# Altium project haptic_core_v2.PrjPcb (part 2 of 2)

## Sheet MCU_nRF5340.SchDoc
size A2; SheetNumber: 2; SheetTotal: 5
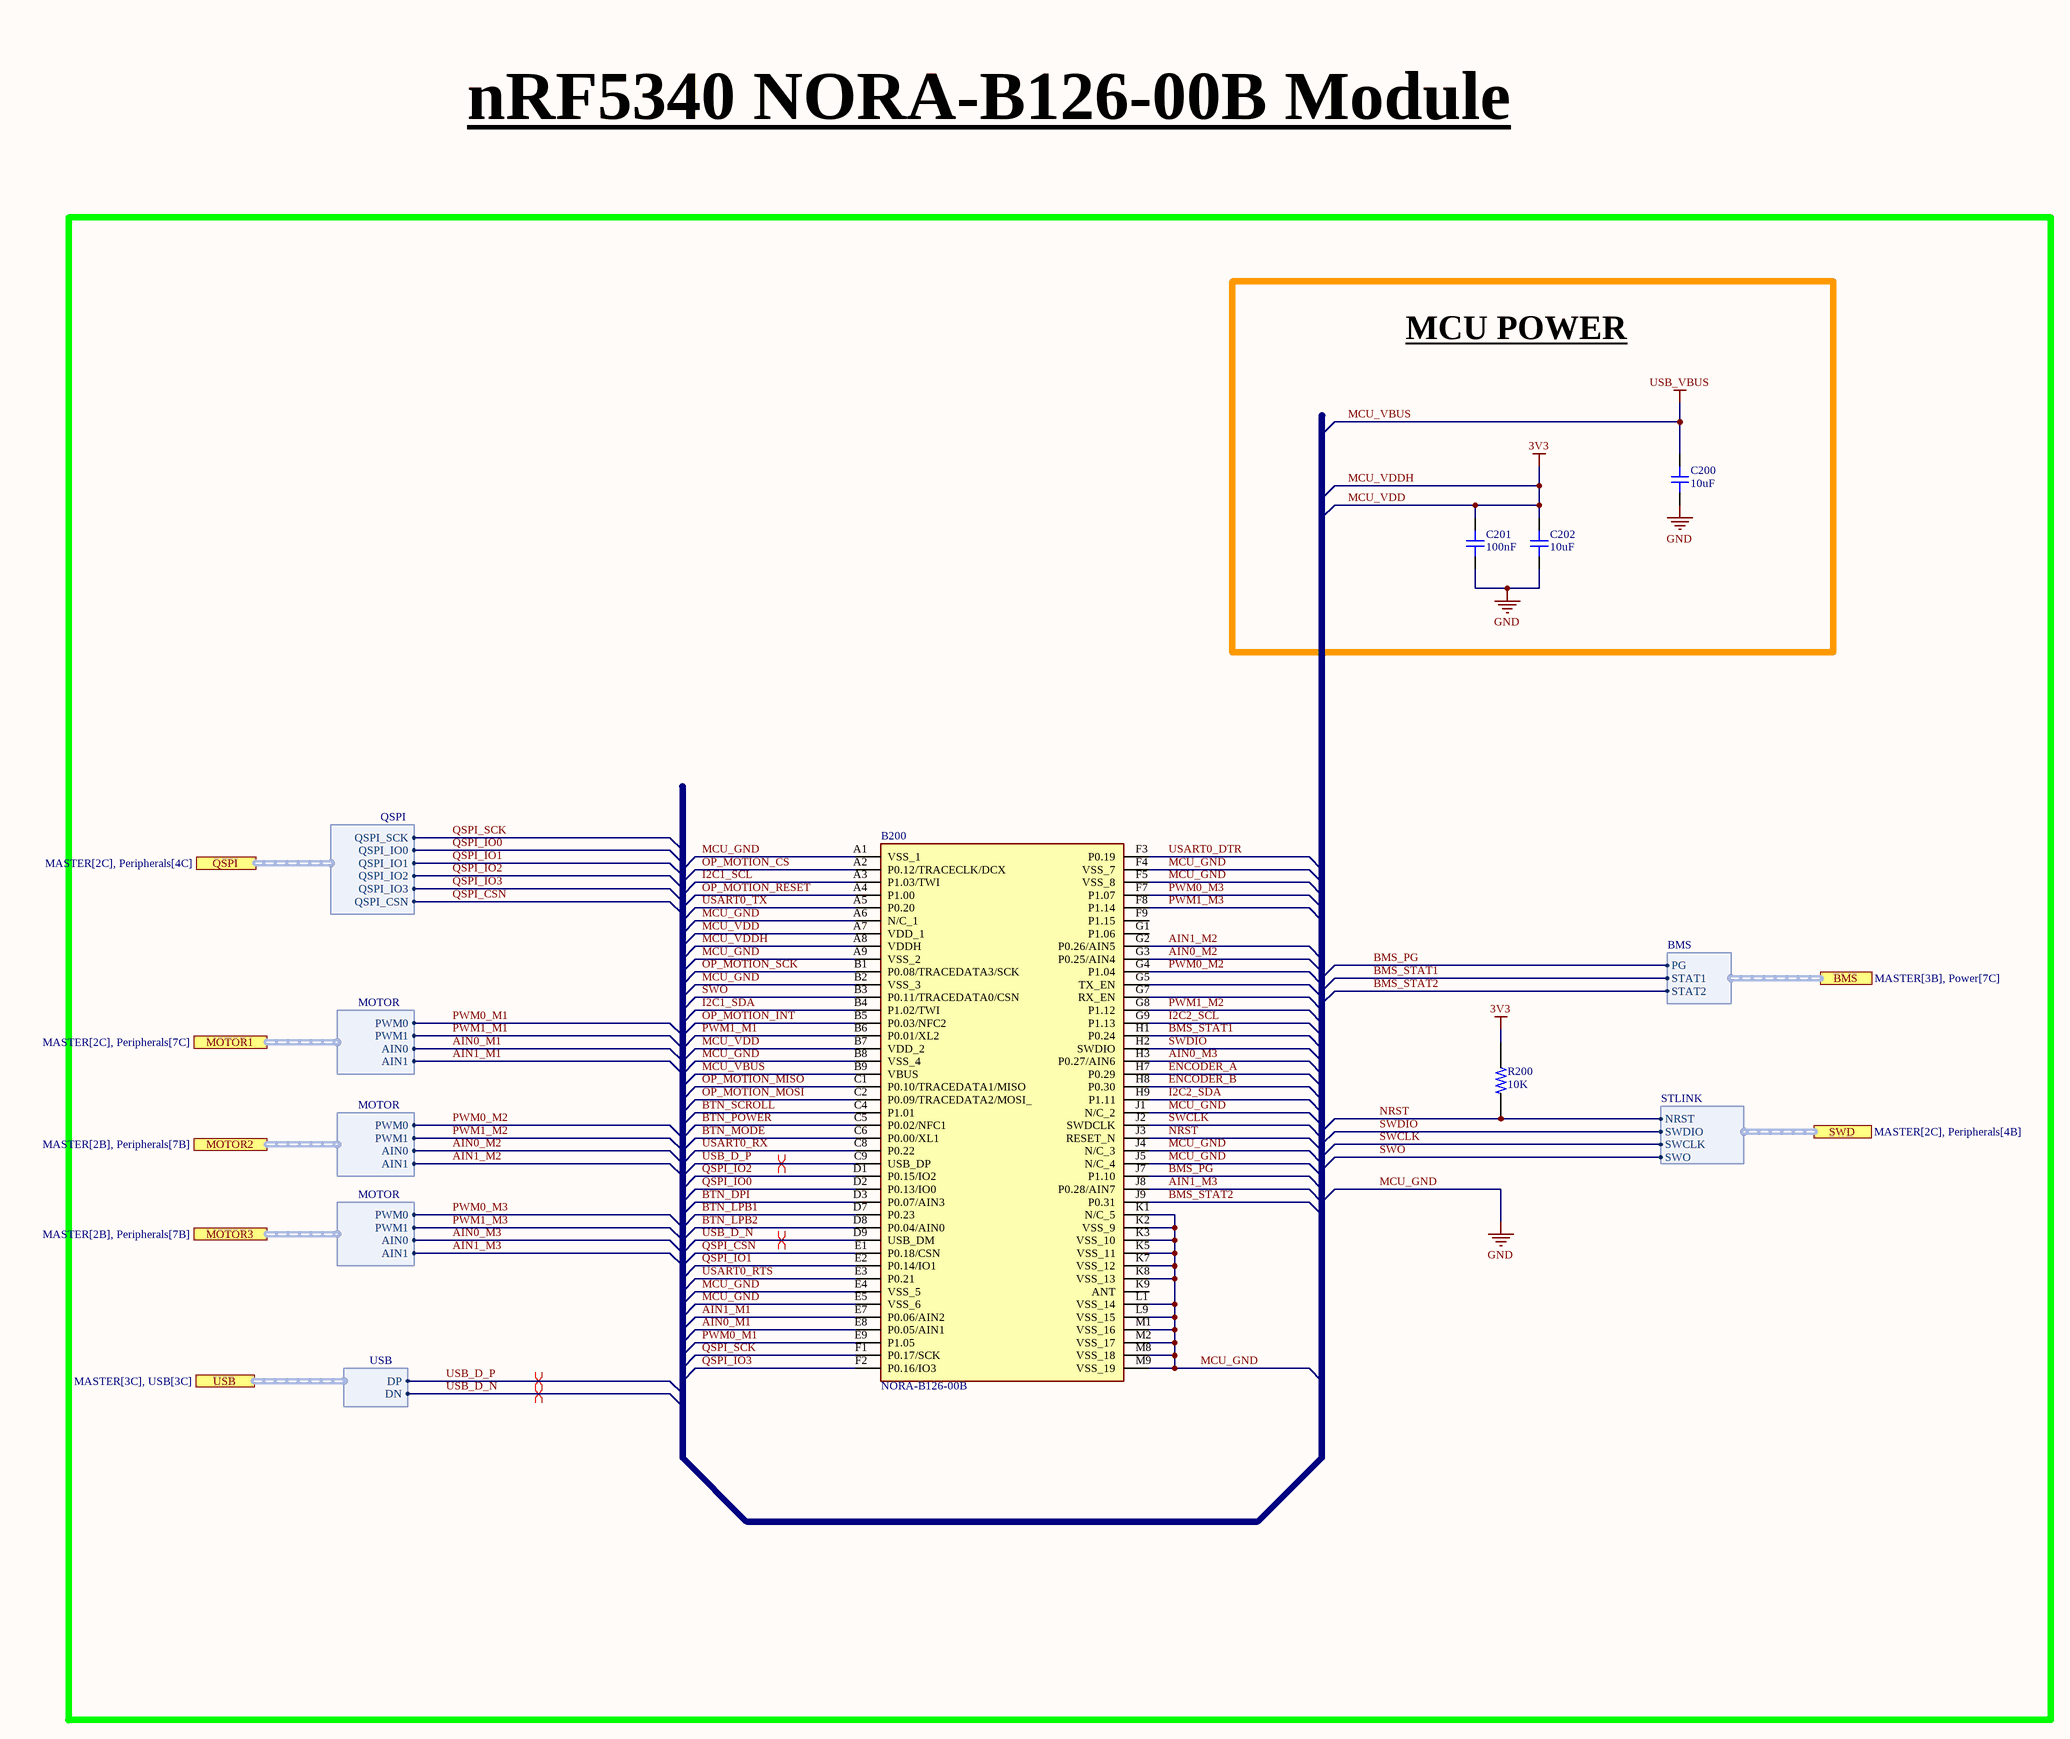
[diagram p4: MCU_nRF5340.SchDoc]

### Parts
B200  NORA-B126-00B  [NORAB12600B]
C200  10uF  [CAP_0603]
C201  100nF  [CAP_0603]
C202  10uF  [CAP_0603]
R200  10K  [RESC1607X60N]

### Blocks framed on the sheet
MCU POWER: C200-C202

### Ports
BMS (harness BMS, see MASTER[3B], Power[7C]), MOTOR1 (harness MOTOR, see MASTER[2C], Peripherals[7C]), MOTOR2 (harness MOTOR, see MASTER[2B], Peripherals[7B]), MOTOR3 (harness MOTOR, see MASTER[2B], Peripherals[7B]), QSPI (harness QSPI, see MASTER[2C], Peripherals[4C]), SWD (harness STLINK, see MASTER[2C], Peripherals[4B]), USB (harness USB, see MASTER[3C], USB[3C])

### Harnesses
QSPI: QSPI_SCK, QSPI_IO0, QSPI_IO1, QSPI_IO2, QSPI_IO3, QSPI_CSN
STLINK: NRST, SWDIO, SWCLK, SWO
BMS: PG, STAT2, STAT1
USB: DN, DP
MOTOR: PWM1, PWM0, AIN0, AIN1

### Nets
MCU_GND: B200.A1(VSS_1) B200.A6(N/C_1) B200.A9(VSS_2) B200.B2(VSS_3) B200.B8(VSS_4) B200.E4(VSS_5) B200.E5(VSS_6) B200.F4(VSS_7) B200.F5(VSS_8) B200.J1(N/C_2) B200.J4(N/C_3) B200.J5(N/C_4) B200.K1(N/C_5) B200.K2(VSS_9) B200.K3(VSS_10) B200.K5(VSS_11) B200.K7(VSS_12) B200.K8(VSS_13) B200.L1(VSS_14) B200.L9(VSS_15) B200.M1(VSS_16) B200.M2(VSS_17) B200.M8(VSS_18) B200.M9(VSS_19) C200.1 C201.1 C202.1  [also labelled GND]
MCU_VBUS: B200.B9(VBUS) C200.2  [also labelled USB_VBUS]
MCU_VDD: B200.A7(VDD_1) B200.A8(VDDH) B200.B7(VDD_2) C201.2 C202.2 R200.1  [also labelled 3V3, MCU_VDDH]
AIN0_M1: B200.E8(P0.05/AIN1) ; port MOTOR1.AIN0
AIN0_M2: B200.G3(P0.25/AIN4) ; port MOTOR2.AIN0
AIN0_M3: B200.H3(P0.27/AIN6) ; port MOTOR3.AIN0
AIN1_M1: B200.E7(P0.06/AIN2) ; port MOTOR1.AIN1
AIN1_M2: B200.G2(P0.26/AIN5) ; port MOTOR2.AIN1
AIN1_M3: B200.J8(P0.28/AIN7) ; port MOTOR3.AIN1
BMS_PG: B200.J7(P1.10) ; port BMS.PG
BMS_STAT1: B200.H1(P0.24) ; port BMS.STAT1
BMS_STAT2: B200.J9(P0.31) ; port BMS.STAT2
BTN_DPI: B200.D3(P0.07/AIN3)
BTN_LPB1: B200.D7(P0.23)
BTN_LPB2: B200.D8(P0.04/AIN0)
BTN_MODE: B200.C6(P0.00/XL1)
BTN_POWER: B200.C5(P0.02/NFC1)
BTN_SCROLL: B200.C4(P1.01)
ENCODER_A: B200.H7(P0.29)
ENCODER_B: B200.H8(P0.30)
I2C1_SCL: B200.A3(P1.03/TWI)
I2C1_SDA: B200.B4(P1.02/TWI)
I2C2_SCL: B200.G9(P1.13)
I2C2_SDA: B200.H9(P1.11)
NRST: B200.J3(RESET_N) R200.2 ; port SWD.NRST
OP_MOTION_CS: B200.A2(P0.12/TRACECLK/DCX)
OP_MOTION_INT: B200.B5(P0.03/NFC2)
OP_MOTION_MISO: B200.C1(P0.10/TRACEDATA1/MISO)
OP_MOTION_MOSI: B200.C2(P0.09/TRACEDATA2/MOSI_)
OP_MOTION_RESET: B200.A4(P1.00)
OP_MOTION_SCK: B200.B1(P0.08/TRACEDATA3/SCK)
PWM0_M1: B200.E9(P1.05) ; port MOTOR1.PWM0
PWM0_M2: B200.G4(P1.04) ; port MOTOR2.PWM0
PWM0_M3: B200.F7(P1.07) ; port MOTOR3.PWM0
PWM1_M1: B200.B6(P0.01/XL2) ; port MOTOR1.PWM1
PWM1_M2: B200.G8(P1.12) ; port MOTOR2.PWM1
PWM1_M3: B200.F8(P1.14) ; port MOTOR3.PWM1
QSPI_CSN: B200.E1(P0.18/CSN) ; port QSPI.QSPI_CSN
QSPI_IO0: B200.D2(P0.13/IO0) ; port QSPI.QSPI_IO0
QSPI_IO1: B200.E2(P0.14/IO1) ; port QSPI.QSPI_IO1
QSPI_IO2: B200.D1(P0.15/IO2) ; port QSPI.QSPI_IO2
QSPI_IO3: B200.F2(P0.16/IO3) ; port QSPI.QSPI_IO3
QSPI_SCK: B200.F1(P0.17/SCK) ; port QSPI.QSPI_SCK
SWCLK: B200.J2(SWDCLK) ; port SWD.SWCLK
SWDIO: B200.H2(SWDIO) ; port SWD.SWDIO
SWO: B200.B3(P0.11/TRACEDATA0/CSN) ; port SWD.SWO
USART0_DTR: B200.F3(P0.19)
USART0_RTS: B200.E3(P0.21)
USART0_RX: B200.C8(P0.22)
USART0_TX: B200.A5(P0.20)
USB_D_N: B200.D9(USB_DM) ; port USB.DN
USB_D_P: B200.C9(USB_DP) ; port USB.DP

Not connected (* = marked no-connect by the designer): B200 F9(P1.15) G1(P1.06) G5(TX_EN) G7(RX_EN) K9(ANT)

### Layout directives
differential pair: USB_D_N, USB_D_P

### Notes on the sheet
- nRF5340 NORA-B126-00B Module

### Library data of the parts
B200 = NORA-B126-00B: Stand-alone dual-core Bluetooth 5.2 Low Energy and IEEE 802.15.4 module; Manufacturer_Name: u-blox; Geometry.Height: 1.8mm; Mouser Part Number: 377-NORA-B126-00B; Mouser Price/Stock: https://www.mouser.co.uk/ProductDetail/u-blox/NORA-B126-00B?qs=MyNHzdoqoQLrkbXxJ8%252ByHg%3D%3D; Manufacturer_Part_Number: NORA-B126-00B; Datasheet Link: https://content.u-blox.com/sites/default/files/NORA-B1_DataSheet_UBX-20027119.pdf
C200-C202 = CAP_0603: Capacitor SMD 0603; Manufacturer: *; Manufacturer Part Number: *; Distributor Link: *; LCSC: *; Rating: *; Dielectric: *
R200 = RC0603JR0710KL: 10 kOhms Â±5% 0.1W, 1/10W Chip Resistor 0603 (1608 Metric) Moisture Resistant Thick Film; MF: Yageo; SnapEDA_Link: https://www.snapeda.com/parts/RC0603JR0710KL/Yageo/view-part/?ref=snap; Package: 0603 Yageo; Value: *; MP: RC0603JR0710KL; Check_prices: https://www.snapeda.com/parts/RC0603JR0710KL/Yageo/view-part/?ref=eda

## Nets that join several sheets
MCU_GND: Power (32 pins), USB (14 pins), Peripherals (19 pins), MCU_nRF5340 (27 pins)
MCU_VBUS: Power (9 pins), USB (8 pins), MCU_nRF5340 (B200.B9 C200.2)
MCU_VDD: Power (C415.2 C416.2 U402.5), Peripherals (12 pins), MCU_nRF5340 (6 pins)
AIN0_M1: Peripherals (C303.2 R301.1), MCU_nRF5340 (B200.E8)
AIN0_M2: Peripherals (C307.2 R303.1), MCU_nRF5340 (B200.G3)
AIN0_M3: Peripherals (C311.2 R305.1), MCU_nRF5340 (B200.H3)
AIN1_M1: Peripherals (C304.2 R300.2), MCU_nRF5340 (B200.E7)
AIN1_M2: Peripherals (C308.2 R302.2), MCU_nRF5340 (B200.G2)
AIN1_M3: Peripherals (C312.2 R304.2), MCU_nRF5340 (B200.J8)
BMS_PG: Power (U400.6), MCU_nRF5340 (B200.J7)
BMS_STAT1: Power (U400.8), MCU_nRF5340 (B200.H1)
BMS_STAT2: Power (U400.7), MCU_nRF5340 (B200.J9)
NRST: Peripherals (J302.3), MCU_nRF5340 (B200.J3 R200.2)
PWM0_M1: Peripherals (U300.1), MCU_nRF5340 (B200.E9)
PWM0_M2: Peripherals (U301.1), MCU_nRF5340 (B200.G4)
PWM0_M3: Peripherals (U302.1), MCU_nRF5340 (B200.F7)
PWM1_M1: Peripherals (U300.2), MCU_nRF5340 (B200.B6)
PWM1_M2: Peripherals (U301.2), MCU_nRF5340 (B200.G8)
PWM1_M3: Peripherals (U302.2), MCU_nRF5340 (B200.F8)
QSPI_CSN: Peripherals (IC300.1), MCU_nRF5340 (B200.E1)
QSPI_IO0: Peripherals (IC300.5), MCU_nRF5340 (B200.D2)
QSPI_IO1: Peripherals (IC300.2), MCU_nRF5340 (B200.E2)
QSPI_IO2: Peripherals (IC300.3), MCU_nRF5340 (B200.D1)
QSPI_IO3: Peripherals (IC300.7), MCU_nRF5340 (B200.F2)
QSPI_SCK: Peripherals (IC300.6), MCU_nRF5340 (B200.F1)
SWCLK: Peripherals (J302.4), MCU_nRF5340 (B200.J2)
SWDIO: Peripherals (J302.2), MCU_nRF5340 (B200.H2)
SWO: Peripherals (J302.6), MCU_nRF5340 (B200.B3)
USB_D_N: USB (D500.3 D500.4 J500.A7 J500.B7), MCU_nRF5340 (B200.D9)
USB_D_P: USB (D500.1 D500.6 J500.A6 J500.B6), MCU_nRF5340 (B200.C9)